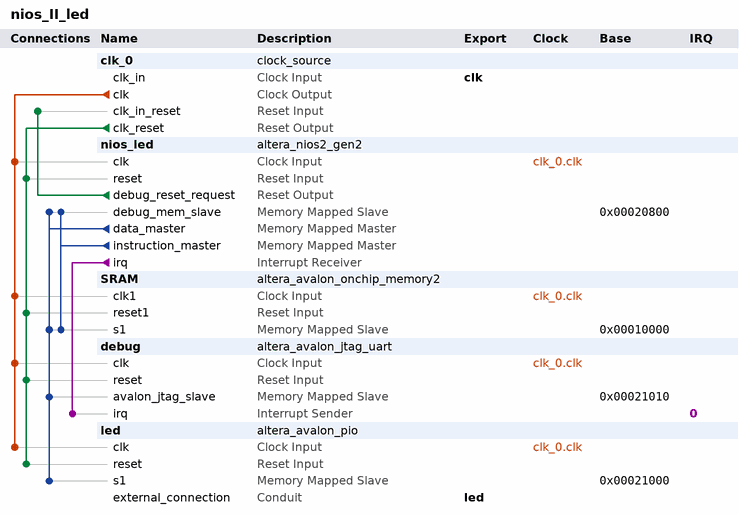
[diagram p0: system contents]
# Platform Designer (Qsys) system nios_II_led, MAX 10 10M50DAF484C7G
# Parameters at their usual value, and those the tool derives, are not listed.
package require -exact qsys 18.1
create_system nios_II_led
set_project_property DEVICE_FAMILY {MAX 10}
set_project_property DEVICE 10M50DAF484C7G

add_instance clk_0 clock_source 18.1
set_instance_parameter_value clk_0 clockFrequency 50000000

add_instance nios_led altera_nios2_gen2 18.1
set_instance_parameter_value nios_led dcache_size 2048
set_instance_parameter_value nios_led exceptionSlave SRAM.s1
set_instance_parameter_value nios_led icache_size 4096
set_instance_parameter_value nios_led impl Fast
set_instance_parameter_value nios_led resetSlave SRAM.s1

add_instance SRAM altera_avalon_onchip_memory2 18.1
set_instance_parameter_value SRAM dataWidth 32
set_instance_parameter_value SRAM dualPort false
set_instance_parameter_value SRAM initMemContent true
set_instance_parameter_value SRAM initializationFileName onchip_mem.hex
set_instance_parameter_value SRAM memorySize 40960

add_instance debug altera_avalon_jtag_uart 18.1
set_instance_parameter_value debug simInteractiveOptions NO_INTERACTIVE_WINDOWS

add_instance led altera_avalon_pio 18.1
set_instance_parameter_value led direction Output
set_instance_parameter_value led width 10

# connections
add_connection clk_0.clk debug.clk clock
add_connection clk_0.clk led.clk clock
add_connection clk_0.clk nios_led.clk clock
add_connection clk_0.clk SRAM.clk1 clock
add_connection clk_0.clk_reset debug.reset reset
add_connection clk_0.clk_reset led.reset reset
add_connection clk_0.clk_reset nios_led.reset reset
add_connection clk_0.clk_reset SRAM.reset1 reset
add_connection nios_led.debug_reset_request clk_0.clk_in_reset reset
add_connection nios_led.data_master debug.avalon_jtag_slave avalon
set_connection_parameter_value nios_led.data_master/debug.avalon_jtag_slave baseAddress 0x00021010
add_connection nios_led.data_master led.s1 avalon
set_connection_parameter_value nios_led.data_master/led.s1 baseAddress 0x00021000
add_connection nios_led.data_master nios_led.debug_mem_slave avalon
set_connection_parameter_value nios_led.data_master/nios_led.debug_mem_slave baseAddress 0x00020800
add_connection nios_led.data_master SRAM.s1 avalon
set_connection_parameter_value nios_led.data_master/SRAM.s1 baseAddress 0x00010000
add_connection nios_led.instruction_master nios_led.debug_mem_slave avalon
set_connection_parameter_value nios_led.instruction_master/nios_led.debug_mem_slave baseAddress 0x00020800
add_connection nios_led.instruction_master SRAM.s1 avalon
set_connection_parameter_value nios_led.instruction_master/SRAM.s1 baseAddress 0x00010000
add_connection nios_led.irq debug.irq interrupt
set_connection_parameter_value nios_led.irq/debug.irq irqNumber 0

# exported interfaces
add_interface clk clock sink
set_interface_property clk EXPORT_OF clk_0.clk_in
add_interface led conduit end
set_interface_property led EXPORT_OF led.external_connection

set_interconnect_requirement {$system} qsys_mm.clockCrossingAdapter HANDSHAKE
set_interconnect_requirement {$system} qsys_mm.enableEccProtection FALSE
set_interconnect_requirement {$system} qsys_mm.insertDefaultSlave FALSE
set_interconnect_requirement {$system} qsys_mm.maxAdditionalLatency 1

save_system nios_II_led.qsys
